# EAGLE design quickpi (EAGLE 7.7.0)
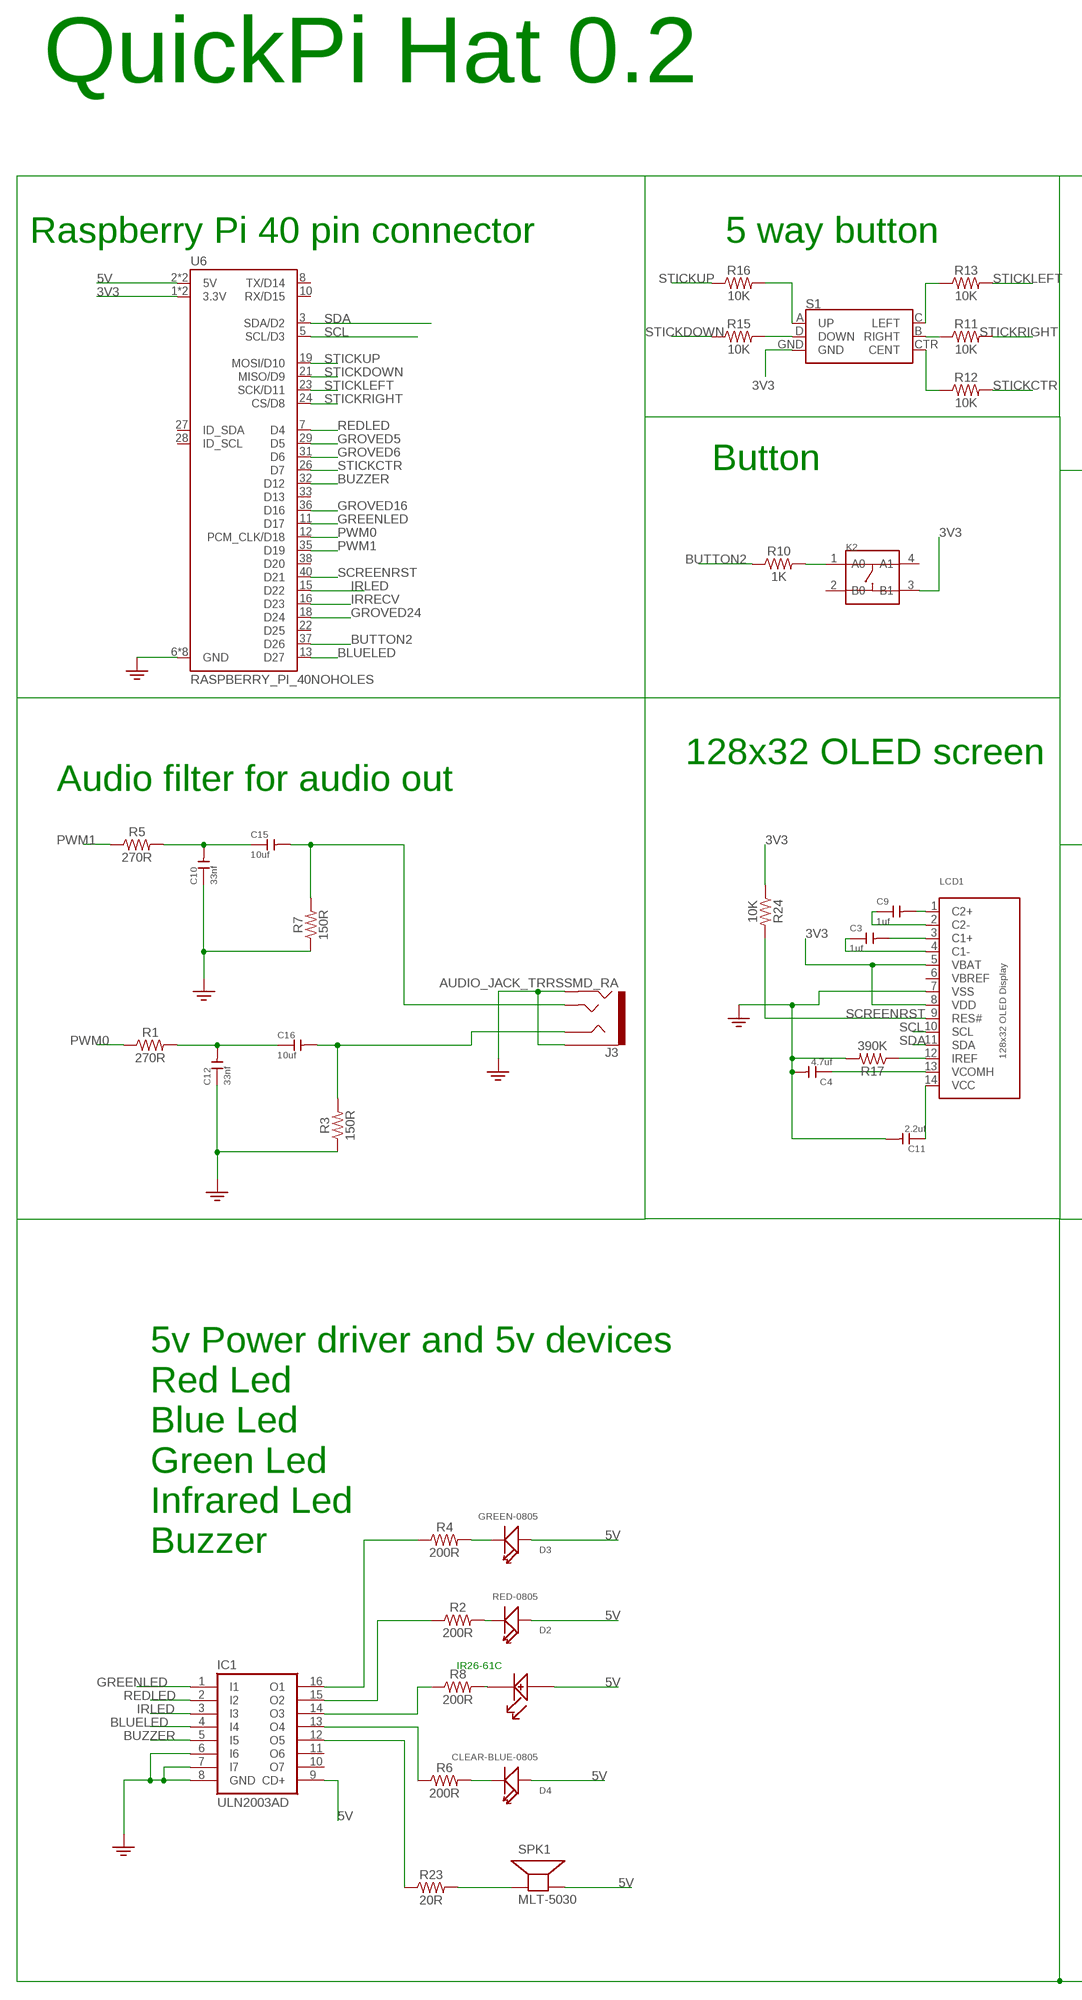
[diagram p0: schematic, sheet 1, part 1 of 2]
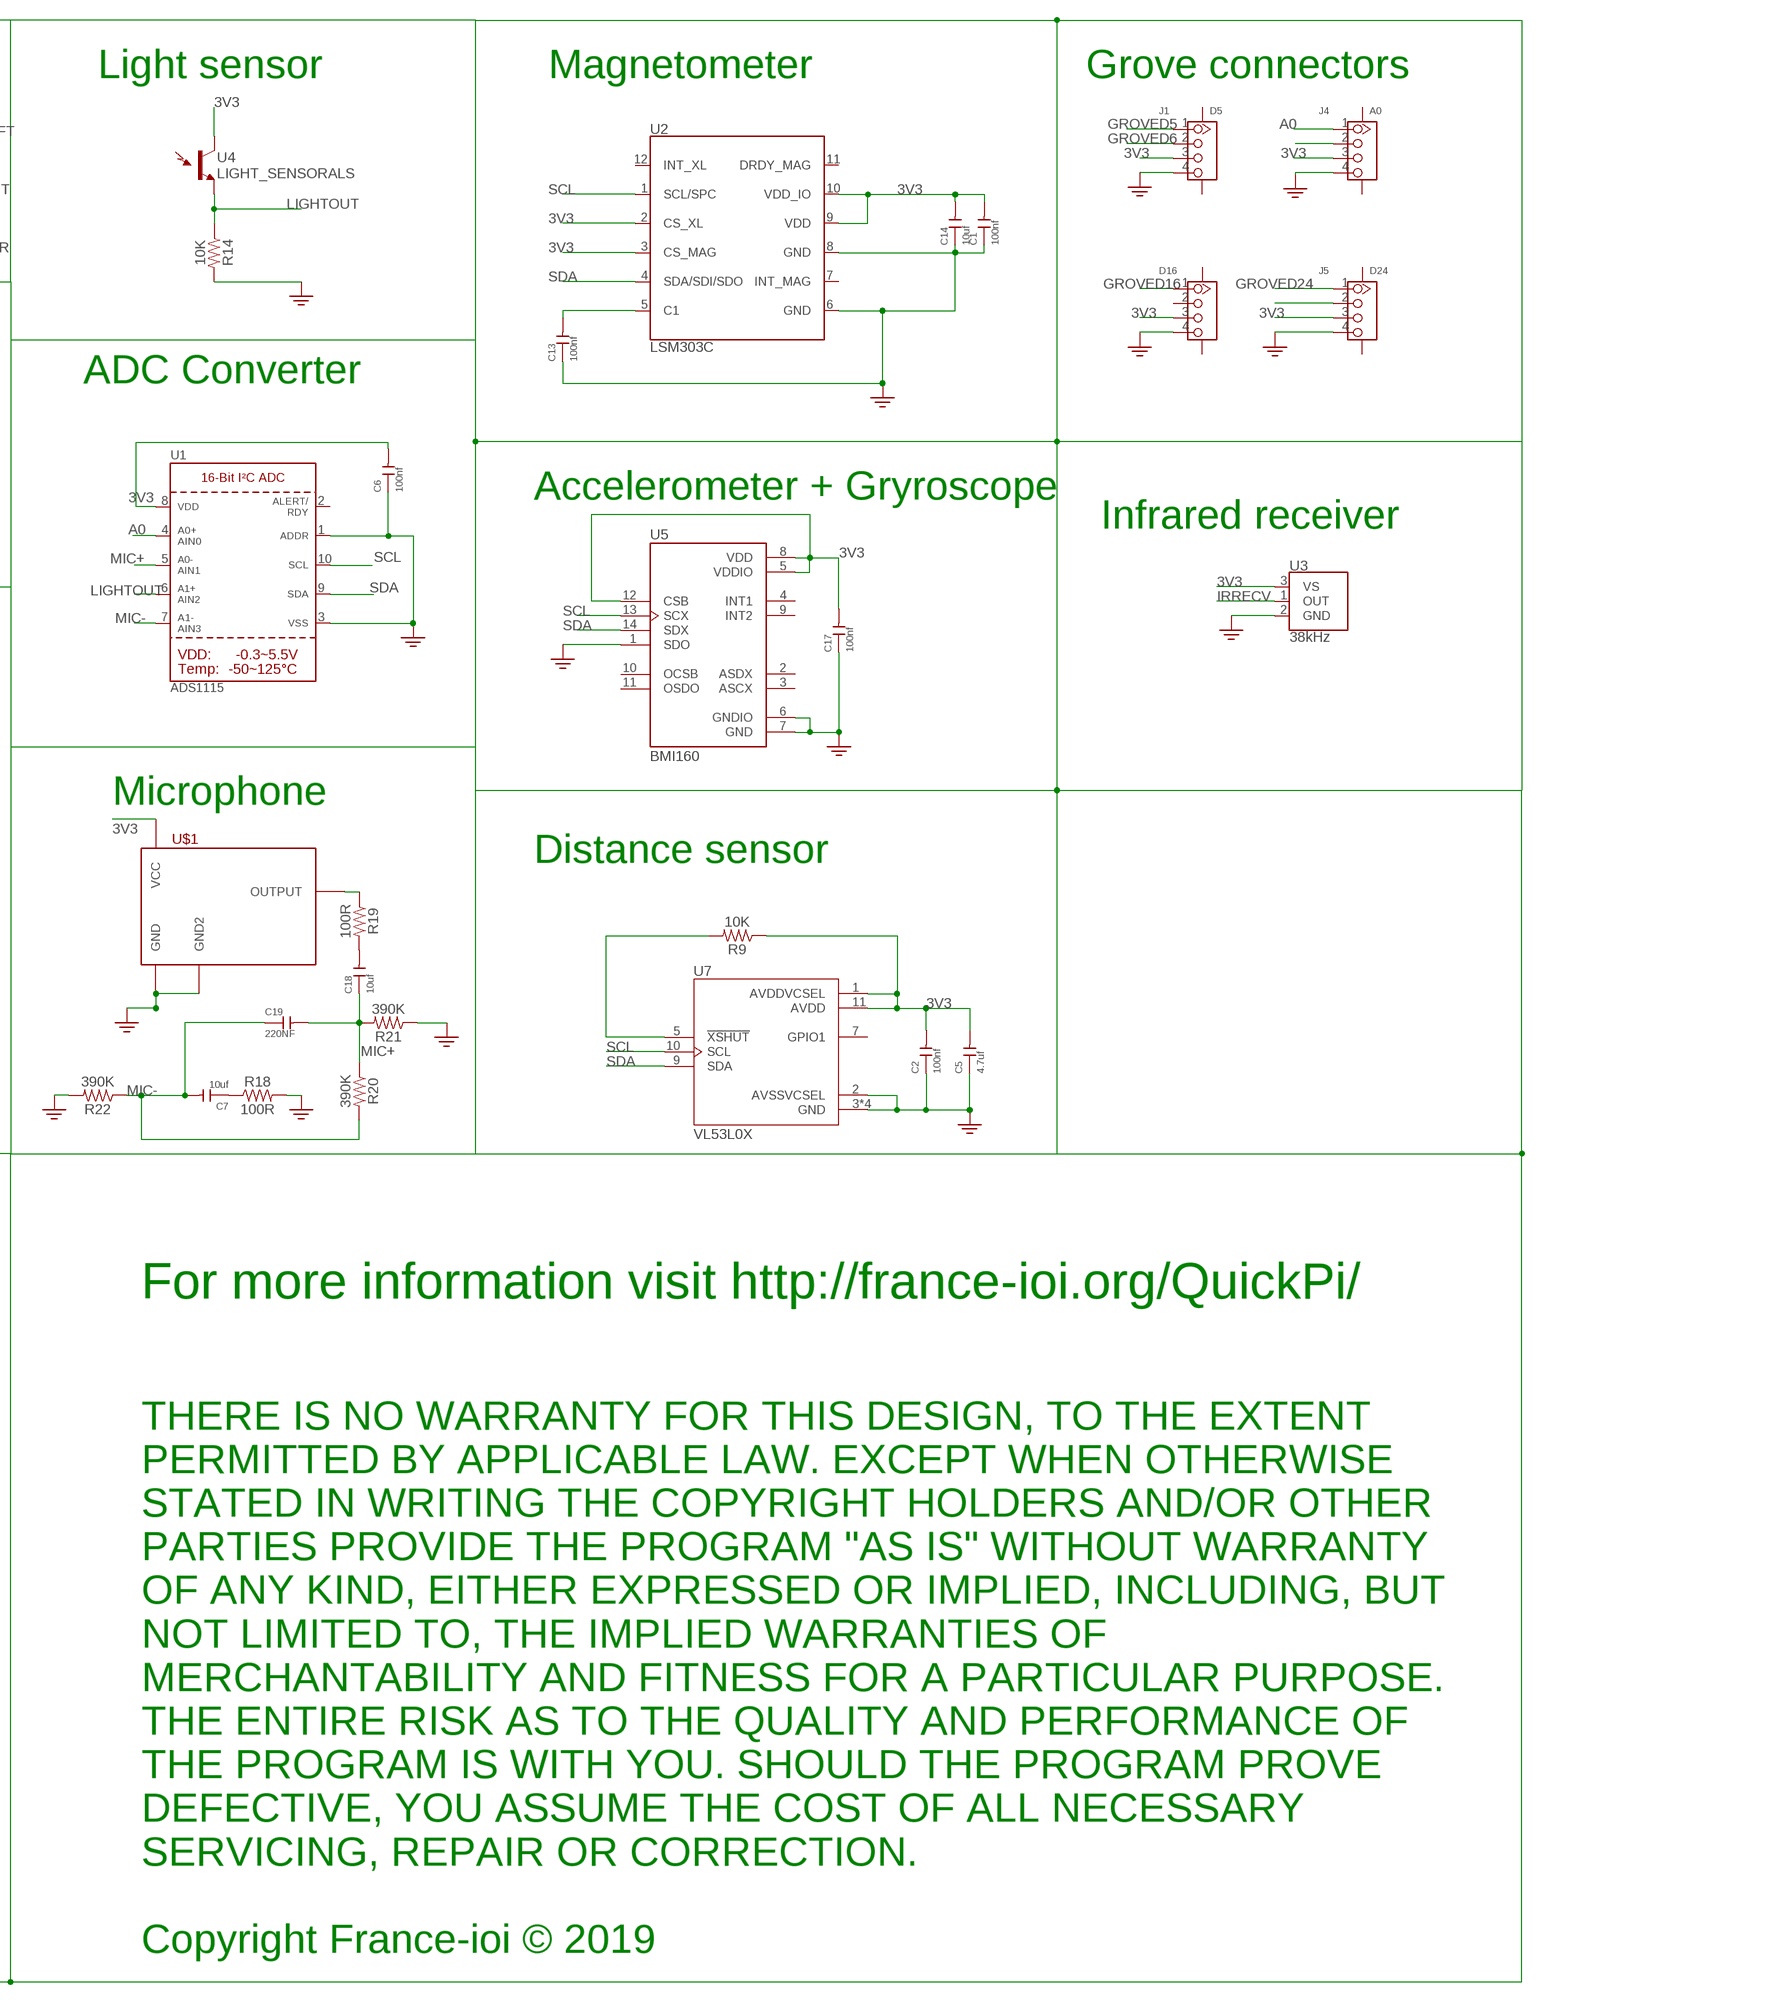
[diagram p1: schematic, sheet 1, part 2 of 2]

## Parts
C1  100nf  CERAMIC-100NF-25V-10%-X7R(0402)  [C0402]
C2  100nf  CERAMIC-100NF-25V-10%-X7R(0402)  [C0402]
C3  1uf  CERAMIC-1UF-10V-10%-X5R(0402)  [C0402]
C4  4.7uf  CERAMIC-4.7UF-6.3V-20%-X5R(0402)  [C0402]
C5  4.7uf  CERAMIC-4.7UF-6.3V-20%-X5R(0402)  [C0402]
C6  100nf  CERAMIC-100NF-25V-10%-X7R(0402)  [C0402]
C7  10uf  CERAMIC-1UF-10V-10%-X5R(0402)  [C0402]
C9  1uf  CERAMIC-1UF-10V-10%-X5R(0402)  [C0402]
C10  33nf  CERAMIC-10UF-6.3V-20%-X5R(0402)  [C0402]
C11  2.2uf  CERAMIC-4.7UF-6.3V-20%-X5R(0402)  [C0402]
C12  33nf  CERAMIC-10UF-6.3V-20%-X5R(0402)  [C0402]
C13  100nf  CERAMIC-100NF-25V-10%-X7R(0402)  [C0402]
C14  10uf  CERAMIC-10UF-6.3V-20%-X5R(0402)  [C0402]
C15  10uf  CERAMIC-10UF-6.3V-20%-X5R(0402)  [C0402]
C16  10uf  CERAMIC-10UF-6.3V-20%-X5R(0402)  [C0402]
C17  100nf  CERAMIC-100NF-25V-10%-X7R(0402)  [C0402]
C18  10uf  CERAMIC-1UF-10V-10%-X5R(0402)  [C0402]
C19  220NF  CERAMIC-220NF-16V-10%-X7R(0402)  [C0402]
D2  RED-0805  SMD-LED-CLEAR-RED(0805)  [LED-0805]
D3  GREEN-0805  SMD-LED-CLEAR-GREEN(0805)  [LED-0805]
D4  CLEAR-BLUE-0805  SMD-LED-CLEAR-BLUE(0805)  [LED-0805]
D16  GROVE-CONNECTOR-SMD-90D(4+2P-2.0)  [HW4-SMD-2.0-90D]
IC1  ULN2003AD  [SO16]
J1  D5  GROVE-CONNECTOR-SMD-90D(4+2P-2.0)  [HW4-SMD-2.0-90D]
J3  AUDIO_JACK_TRRSSMD_RA  [AUDIO_JACK_3.5MM_TRRS_SMD_RA]
J4  A0  GROVE-CONNECTOR-SMD-90D(4+2P-2.0)  [HW4-SMD-2.0-90D]
J5  D24  GROVE-CONNECTOR-SMD-90D(4+2P-2.0)  [HW4-SMD-2.0-90D]
K2  SMD-SWITCH-TACTILE-SPST-NO(4P-D6.0MM)  [SW4-SMD-6.0X6.0X5.0MM]
LCD1  DISP_OLED_UG-2832HSWEG02  [UG-2832HSWEG02_WRAPUNDER]
R1  270R  RESISTOR0402  [0402]
R2  200R  RESISTOR0402  [0402]
R3  150R  RESISTOR0402  [0402]
R4  200R  RESISTOR0402  [0402]
R5  270R  RESISTOR0402  [0402]
R6  200R  RESISTOR0402  [0402]
R7  150R  RESISTOR0402  [0402]
R8  200R  RESISTOR0402  [0402]
R9  10K  RESISTOR0402  [0402]
R10  1K  RESISTOR0402  [0402]
R11  10K  RESISTOR0402  [0402]
R12  10K  RESISTOR0402  [0402]
R13  10K  RESISTOR0402  [0402]
R14  10K  RESISTOR0402  [0402]
R15  10K  RESISTOR0402  [0402]
R16  10K  RESISTOR0402  [0402]
R17  390K  RESISTOR0402  [0402]
R18  100R  RESISTOR0402  [0402]
R19  100R  RESISTOR0402  [0402]
R20  390K  RESISTOR0402  [0402]
R21  390K  RESISTOR0402  [0402]
R22  390K  RESISTOR0402  [0402]
R23  20R  RESISTOR0402  [0402]
R24  10K  RESISTOR0402  [0402]
S1  JOYSTICK_MINI  [JOYSTICK_MINI]
SPK1  MLT-5030  SMT-0540-S-R  [SMT-0540-S-R]
U1  ADS1015  ADS1115  [MSOP10]
U2  LSM303C  [LGA-12]
U3  38kHz  TSOP38238  [TSOP382]
U4  LIGHT_SENSORALS  [ALS-PT19]
U5  BMI160  [PQFN50P300X250X88-14N]
U6  RASPBERRY_PI_40NOHOLES  [RASPBERRY_PI_SHIELD_NOHOLES]
U7  VL53L0X  [SENSOR_VL53L0X]
U$1  MEMS_MIC_SPU0414HR5H-SB  [CSP-4PIN]
U$2  IR26-61C/L302/TR8  [IR26-61C/L302/TR8]

## Nets
3V3: C1.2 C2.2 C5.2 C6.2 C14.2 C17.2 D16.3 J1.3 J4.3 J5.3 K2.3(B1) LCD1.5(VBAT) LCD1.8(VDD) R9.1 R24.1 S1.GND U1.8(VDD) U2.2(CS_XL) U2.3(CS_MAG) U2.9(VDD) U2.10(VDD_IO) U3.3(VS) U4.C(C1) U5.5(VDDIO) U5.8(VDD) U5.12(CSB) U6.1(3.3V) U6.17(3.3V) U7.1(AVDDVCSEL) U7.11(AVDD) U$1.VCC
5V: D2.+ D3.+ D4.+ IC1.9(CD+) SPK1.+(-) U6.2(5V) U6.4(5V) U$2.VCC(GND)
A0: J4.1 U1.4(AIN0)
BLUELED: IC1.4(I4) U6.13(D27)
BUTTON2: R10.1 U6.37(D26)
BUZZER: IC1.5(I5) U6.32(D12)
GND: C1.1 C2.1 C4.2 C5.1 C6.1 C10.1 C11.2 C12.1 C13.1 C14.1 C17.1 D16.4 IC1.6(I6) IC1.7(I7) IC1.8(GND) J1.4 J3.EARTH J3.RING2 J4.4 J5.4 LCD1.7(VSS) R3.1 R7.1 R14.2 R17.2 R18.2 R21.1 R22.2 U1.1(ADDR) U1.3(VSS) U2.6(GND) U2.8(GND) U3.2(GND) U5.1(SDO) U5.6(GNDIO) U5.7(GND) U6.6(GND) U6.9(GND) U6.14(GND) U6.20(GND) U6.25(GND) U6.30(GND) U6.34(GND) U6.39(GND) U7.2(AVSSVCSEL) U7.3(GND) U7.4(GND) U7.6(GND) U7.12(GND) U$1.GND U$1.GND2 ; supply symbol labelled GND2
GREENLED: IC1.1(I1) U6.11(D17)
GROVED5: J1.1 U6.29(D5)
GROVED6: J1.2 U6.31(D6)
GROVED16: D16.1 U6.36(D16)
GROVED24: J5.1 U6.18(D24)
IRLED: IC1.3(I3) U6.15(D22)
IRRECV: U3.1(OUT) U6.16(D23)
LIGHTOUT: R14.1 U1.6(AIN2) U4.E(E1)
MIC+: C18.1 C19.2 R20.1 R21.2 U1.5(AIN1)
MIC-: C7.2 C19.1 R20.2 R22.1 U1.7(AIN3)
N$1: C3.2 LCD1.3(C1+)
N$2: C16.2 J3.RING1 R3.2
N$3: D4.- R6.2
N$5: J4.2
N$6: J5.2
N$7: IC1.13(O4) R6.1
N$8: IC1.15(O2) R2.1
N$9: R8.2 U$2.GND(VCC)
N$10: C15.2 J3.TIP R7.2
N$11: IC1.16(O1) R4.1
N$12: D3.- R4.2
N$13: C10.2 C15.1 R5.2
N$14: C12.2 C16.1 R1.2
N$15: D2.- R2.2
N$16: R9.2 U7.5(!XSHUT)
N$17: C3.1 LCD1.4(C1-)
N$18: C13.2 U2.5(C1)
N$19: R19.1 U$1.OUTPUT
N$20: K2.1(A0) R10.2
N$21: IC1.14(O3) R8.1
N$22: R13.1 S1.C(LEFT)
N$23: R11.1 S1.B(RIGHT)
N$24: IC1.12(O5) R23.1
N$25: R23.2 SPK1.-(+)
N$26: C9.2 LCD1.1(C2+)
N$27: C9.1 LCD1.2(C2-)
N$28: LCD1.12(IREF) R17.1
N$29: R12.1 S1.CTR(CENT)
N$30: C11.1 LCD1.14(VCC)
N$31: R15.2 S1.D(DOWN)
N$32: R16.2 S1.A(UP)
N$33: C4.1 LCD1.13(VCOMH)
N$34: C18.2 R19.2
N$35: C7.1 R18.1
PWM0: R1.1 U6.12(PCM_CLK/D18)
PWM1: R5.1 U6.35(D19)
REDLED: IC1.2(I2) U6.7(D4)
SCL: LCD1.10(SCL) U1.10(SCL) U2.1(SCL/SPC) U5.13(SCX) U6.5(SCL/D3) U7.10(SCL)
SCREENRST: LCD1.9(RES#) R24.2 U6.40(D21)
SDA: LCD1.11(SDA) U1.9(SDA) U2.4(SDA/SDI/SDO) U5.14(SDX) U6.3(SDA/D2) U7.9(SDA)
STICKCTR: R12.2 U6.26(D7)
STICKDOWN: R15.1 U6.21(MISO/D9)
STICKLEFT: R13.2 U6.23(SCK/D11)
STICKRIGHT: R11.2 U6.24(CS/D8)
STICKUP: R16.1 U6.19(MOSI/D10)
Unconnected: D16.2 D16.SS1 D16.SS2 IC1.10(O7) IC1.11(O6) J1.SS1 J1.SS2 J4.SS1 J4.SS2 J5.SS1 J5.SS2 K2.2(B0) K2.4(A1) U1.2(ALERT/RDY) U2.7(INT_MAG) U2.11(DRDY_MAG) U2.12(INT_XL) U5.2(ASDX) U5.3(ASCX) U5.4(INT1) U5.9(INT2) U5.10(OCSB) U5.11(OSDO) U6.8(TX/D14) U6.10(RX/D15) U6.22(D25) U6.27(ID_SDA) U6.28(ID_SCL) U6.33(D13) U6.38(D20) U7.7(GPIO1)

## Notes on the sheet
- QuickPi Hat 0.2
- Light sensor | Magnetometer | Grove connectors
- Raspberry Pi 40 pin connector | 5 way button
- Button
- ADC Converter
- Accelerometer + Gryroscope
- Infrared receiver
- 128x32 OLED screen
- Audio filter for audio out
- Microphone
- Distance sensor
- For more information visit http://france-ioi.org/QuickPi/
- 5v Power driver and 5v devices
  Red Led
  Blue Led
  Green Led
  Infrared Led
  Buzzer
- IR26-61C
- THERE IS NO WARRANTY FOR THIS DESIGN, TO THE EXTENT
  PERMITTED BY APPLICABLE LAW. EXCEPT WHEN OTHERWISE 
  STATED IN WRITING THE COPYRIGHT HOLDERS AND/OR OTHER
  PARTIES PROVIDE THE PROGRAM "AS IS" WITHOUT WARRANTY 
  OF ANY KIND, EITHER EXPRESSED OR IMPLIED, INCLUDING, BUT 
  NOT LIMITED TO, THE IMPLIED WARRANTIES OF 
  MERCHANTABILITY AND FITNESS FOR A PARTICULAR PURPOSE. 
  THE ENTIRE RISK AS TO THE QUALITY AND PERFORMANCE OF 
  THE PROGRAM IS WITH YOU. SHOULD THE PROGRAM PROVE 
  DEFECTIVE, YOU ASSUME THE COST OF ALL NECESSARY
  SERVICING, REPAIR OR CORRECTION.
- Copyright France-ioi © 2019

## Power pins joined to a net without a drawn wire
VBREF: LCD1.6(VBREF)

## Library data of the parts
C1 C2 C6 C13 C17 = OPL_Capacitor:CERAMIC-100NF-25V-10%-X7R(0402): 302010024; MPN: CC0402KRX7R8BB104
C3 C9 = OPL_Capacitor:CERAMIC-1UF-10V-10%-X5R(0402): 302010040; MPN: CC0402KRX5R6BB105
C4 C5 = OPL_Capacitor:CERAMIC-4.7UF-6.3V-20%-X5R(0402): 302010019; MPN: CC0402MRX5R5BB475
C7 C18 = OPL_Capacitor:CERAMIC-1UF-10V-10%-X5R(0402): 302010040; MPN: CC0402KRX5R6BB105; VALUE: 1uf
C10 C12 = OPL_Capacitor:CERAMIC-10UF-6.3V-20%-X5R(0402): 302010053; MPN: CC0402MRX5R5BB106; VALUE: 10uf
C11 = OPL_Capacitor:CERAMIC-4.7UF-6.3V-20%-X5R(0402): 302010019; MPN: CC0402MRX5R5BB475; VALUE: 4.7uf
C14-C16 = OPL_Capacitor:CERAMIC-10UF-6.3V-20%-X5R(0402): 302010053; MPN: CC0402MRX5R5BB106
C19 = OPL_Capacitor:CERAMIC-220NF-16V-10%-X7R(0402): 302010051; MPN: CC0402KRX7R7BB224
D2 = OPL_Optoelectronics:SMD-LED-CLEAR-RED(0805): 304090046; MPN: 17-215SURC/S530-A2/TR8
D3 = OPL_Optoelectronics:SMD-LED-CLEAR-GREEN(0805): 304090057; MPN: 17-215SYGC/S530-E2/TR8
D4 = OPL_Optoelectronics:SMD-LED-CLEAR-BLUE(0805): 304090061; MPN: EL-17-215/BHC-AN1P2/3T
D16 J1 J4 J5 = OPL_Connector:GROVE-CONNECTOR-SMD-90D(4+2P-2.0): 320110032; VALUE: 4P-SMD-2.0-90D
IC1 = uln-udn:ULN2003A: DRIVER ARRAY
J3 = SparkFun-Connectors:AUDIO_JACK_TRRS: Audio Jack - 3.5mm TRRS (SMD) This is a 3.5mm TRRS SMD audio jack. TRRS connectors are the audio-style connectors that you see on some phones, MP3 players and development boards. TRRS stands for “tip, ring, ring, sleeve,” which reflects that this has three conductors and a ground. SparkFun Products: Audio Jack <https://www.sparkfun.com/products/12639> mbed Starter Kit <https://www.sparkfun.com/products/12968> SparkFun TRRS 3.5mm Jack Breakout <https://www.sparkfun.com/products/11570>; PROD_ID: CONN-10676; SF_ID: PRT-12639
K2 = OPL_Switch:SMD-SWITCH-TACTILE-SPST-NO(4P-D6.0MM): 311020004; MPN: DTSM-62K-S-V-T/R(SN431)
LCD1 = microbuilder-eited:DISP_OLED_UG-2832HSWEG02: 128x32 I2C 0.91" Monochrome OLED Display
R1-R24 = SparkFun-Resistors:RESISTOR: Generic Resistor Package
S1 = SparkFun-Switches:JOYSTICK_MINI: Small Tactile Joystick w/ Select Switch A 5-way tactile switch allows for a joystick-like interface in a very small package. Part #: 4UCON SF303GJ26 SparkFun Products 5-way Tactile Switch <https://www.sparkfun.com/products/10063> (COM-10063) Used on SparkFun Block for Intel® Edison - OLED <https://www.sparkfun.com/products/13035> (DEV-13035) Used on CAN-BUS Shield <https://www.sparkfun.com/products/13262> (DEV-13262); PROD_ID: SWCH-09905; SF_SKU: COM-10063
SPK1 = adafruit:SMT-0540-S-R: SMT-0549-S-R Small surface-mount magnetic buzzer
U1 = ADS1115:ADS1115: 16-Bit Del-Sig ADC Four single-ended inputs or two differential inputs Internal PGA I2C interface 2.0-5.5V; AVAILABILITY: Unavailable; DESCRIPTION: 16-Bit ADC with Integrated MUX PGA Comparator Oscillator and Reference; MF: Texas Instruments; MP: ADS1115; PACKAGE: XFQFN-10 Texas Instruments; PRICE: None
U2 = SparkFun-Sensors:LSM303C: Ultra-compact high-performance eCompass module 3D accelerometer and 3D magnetometer Datasheet <http://www.st.com/web/en/resource/technical/document/datasheet/DM00089896.pdf> SparkFun Products SparkFun 6 Degrees of Freedom Breakout - LSM303C <https://www.sparkfun.com/products/13303> (BOB-13303); PROD_ID: IC-12557
U3 = SparkFun-Sensors:TSOP382: Vishay Semiconductor TSOP32838 - 38kHz IR Receiver These products are miniaturized IR receiver modules for infrared remote control systems. A PIN diode and a preamplifier are assembled on a leadframe, the epoxy package contains an IR filter. The demodulated output signal can be directly connected to a microprocessor for decoding.; PROD_ID: SEN-10266
U4 = SparkFun-Sensors:LIGHT_SENSOR: Ambient Light Sensors - Phototransistors Low cost ambient light sensors, consisting of a phototransistor in miniature SMD packages. Output voltage varies with light intensity. SparkFun Products ALS-PT19 Light Sensor <https://www.sparkfun.com/products/12566> (SEN-12566) Ambient Light Sensor - TEMT6000 <https://www.sparkfun.com/products/8348> (SEN-08348) SparkFun Ambient Light Sensor Breakout - TEMT60000 <https://www.sparkfun.com/products/8688> (SEN-08688); PROD_ID: IC-11836; SF_ID: SEN-12566
U5 = BMI160:BMI160: BMI160 2.5 x 3 mm Tiaxial Accelerometer / Gyroscope Inertial Measurement Unit; AVAILABILITY: Unavailable; DESCRIPTION: BMI160 2.5 x 3 mm Tiaxial Accelerometer / Gyroscope Inertial Measurement Unit; MF: Bosch; MP: BMI160; PACKAGE: LGA-14 Bosch; PRICE: None
U6 = SparkFun-Connectors:RASPBERRY_PI_40
U7 = VL53L0X:VL53L0X: World smallest Time-of-Flight ranging and gesture detection sensor; AVAILABILITY: Unavailable; DESCRIPTION: World smallest Time-of-Flight _ToF_ ranging sensor; MF: STMicroelectronics; MP: VL53L0X; PACKAGE: None; PRICE: None
U$1 = fab:MEMS_MIC_SPU0414HR5H-SB
U$2 = pablo:IR26-61C/L302/TR8

## Board
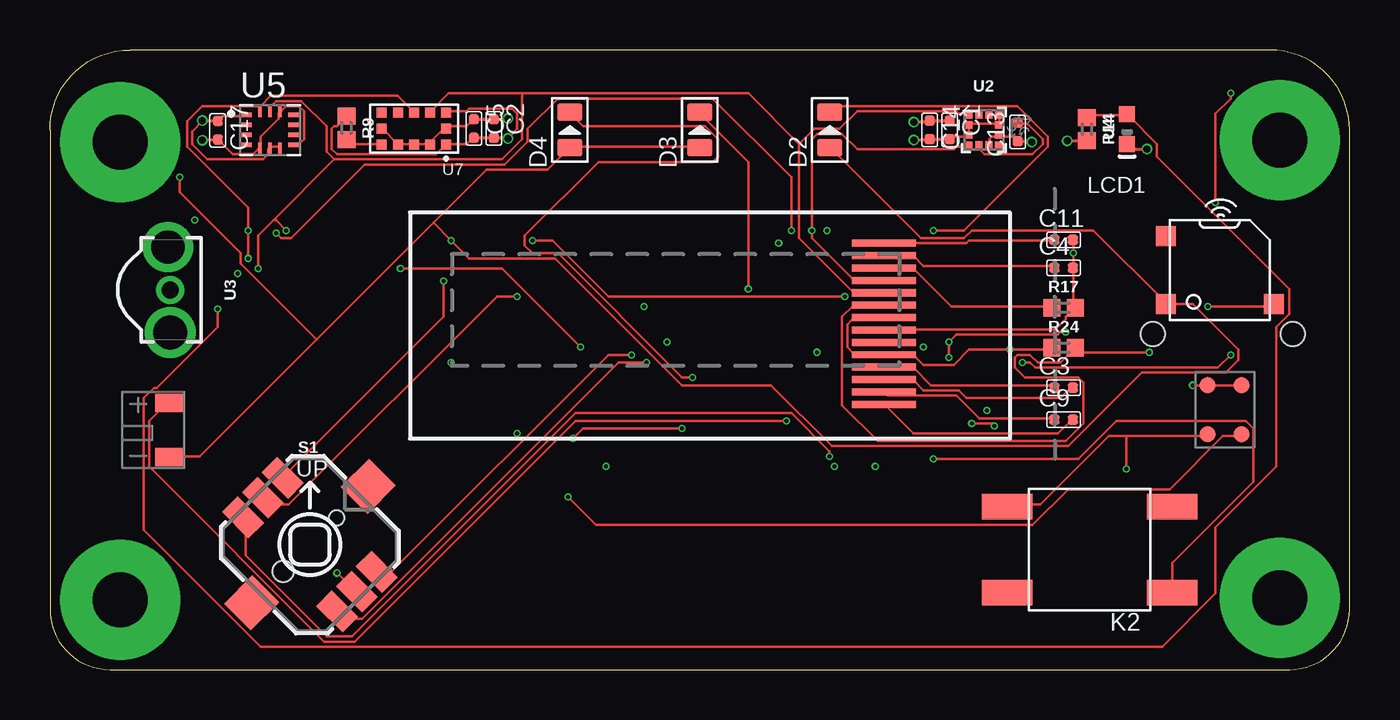
[diagram p2: board, top side]
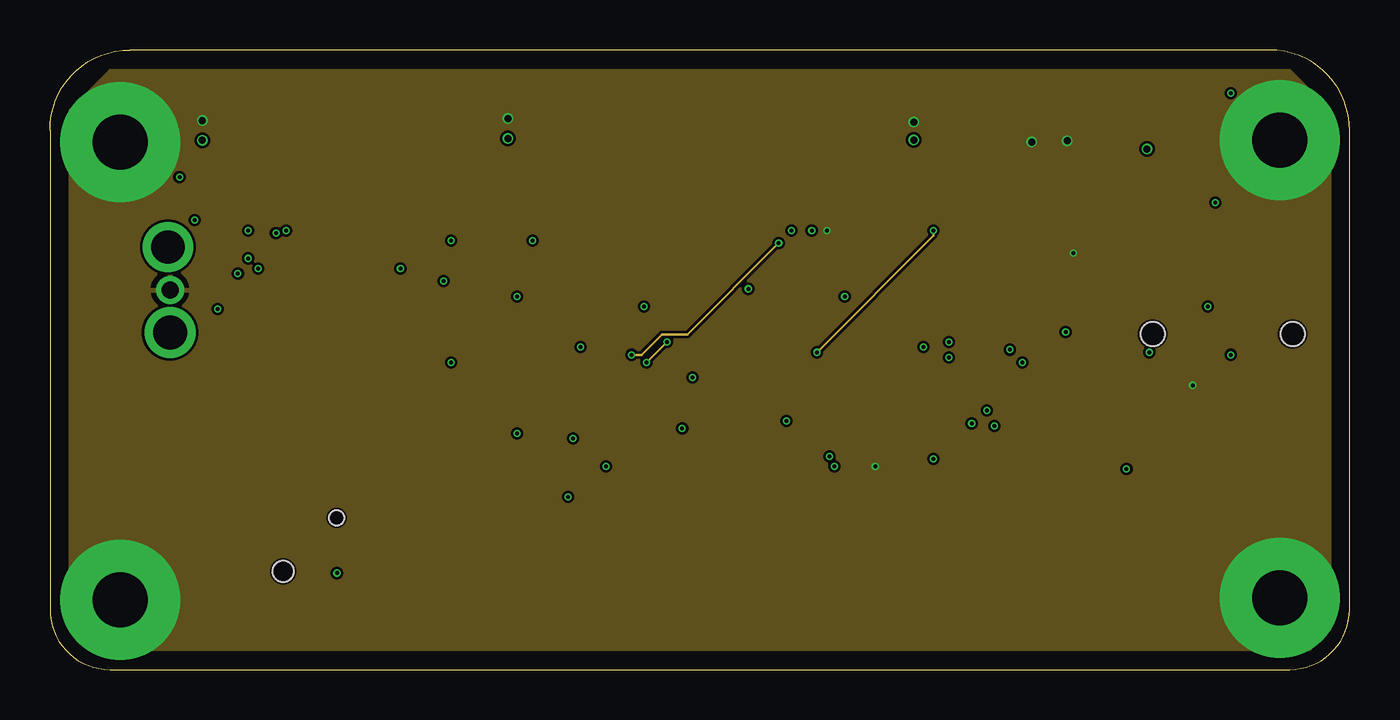
[diagram p3: board, inner layer Route2]
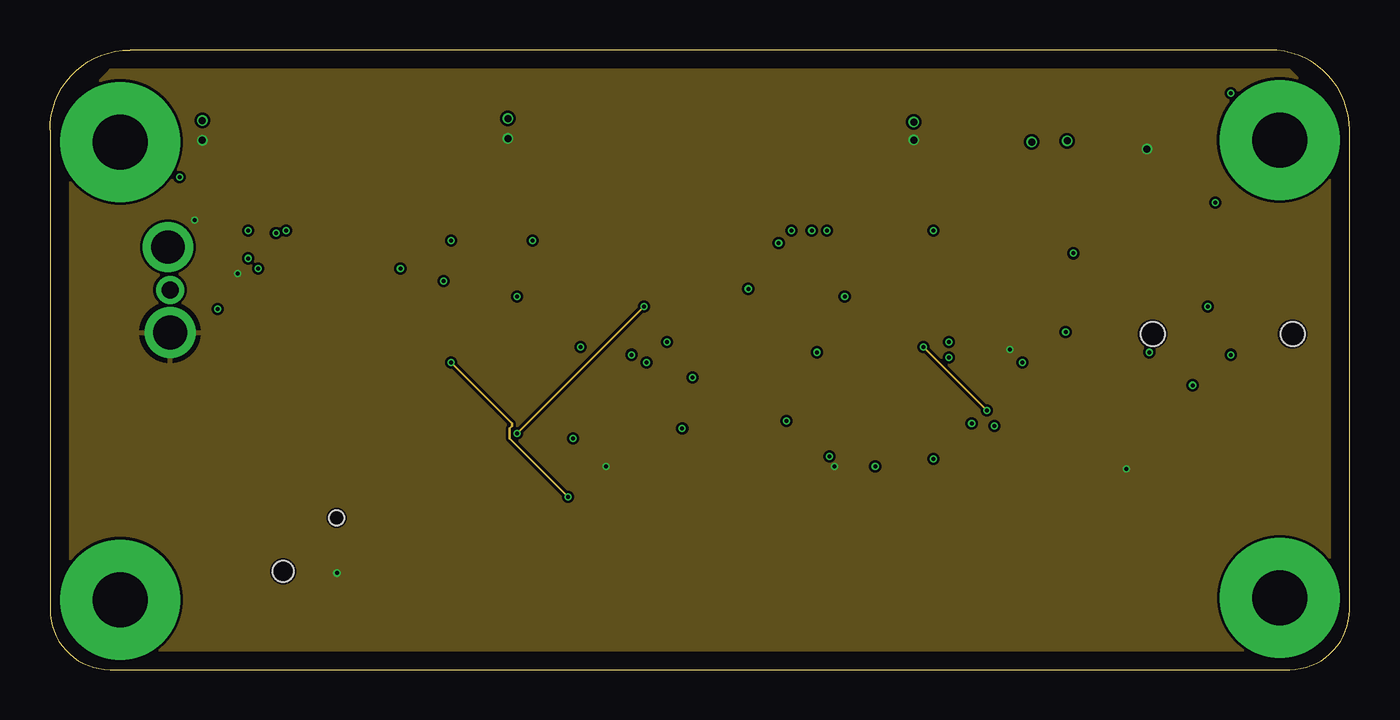
[diagram p4: board, inner layer Route15]
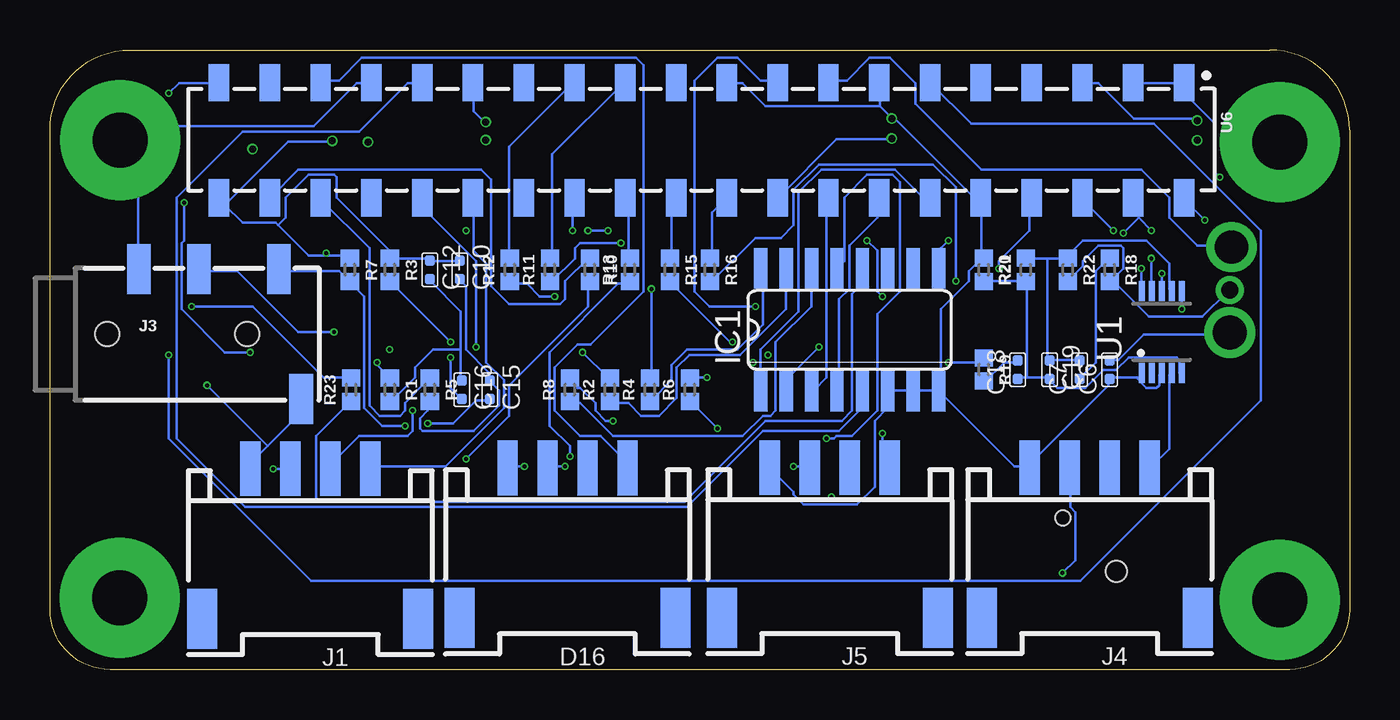
[diagram p5: board, bottom side, seen from below]

Size 65 x 31 mm. Coordinates in mm from the lower left corner, seen from the top.
Outline: 3,0 62,0 arc90 65,3 65,27 arc90 61,31 4,31 arc90 0,27 0,3 arc90 3,0
Copper layers (1*2+15*16): Top 0.035mm / dielectric 0.213359375mm / Route2 0.035mm / dielectric 1.0161mm / Route15 0.035mm / dielectric 0.213359375mm / Bottom 0.035mm
Design rules "SparkFun-4-layer-PCBWAY-LIMIT *": minimum track width 5mil, minimum drill 0.2mm, track to track 5mil, track to pad 5mil, pad to pad 5mil, via to via 5mil, smd to smd 0mil, copper to edge 5mil, drill to drill 5mil, minimum pad ring 3mil, minimum via ring 3mil, stop-mask expansion 4mil, vias tented up to drill 25mil, thermal gap 10mil
vRestrict: area 6.9,22.3 to 58.7,30.4

### Footprints (pad centres in the part's own frame; a part is rotated, then mirrored left to right if it is on the bottom)
C0402 = smd 0.5 x 0.5: 1 0,0.463; 2 0,-0.463
LED-0805 = smd 0.889 x 1.27: + -0.889,0; - 0.889,0
HW4-SMD-2.0-90D = smd 1.01 x 2.74: 1 -3,-0.1; 2 -1,-0.1; 3 1,-0.1; 4 3,-0.1 | smd 1.5 x 3: SS1 -5.4,7.4; SS2 5.4,7.4
SO16 = smd 0.66 x 2.032: 1 -4.445,-3.073; 2 -3.175,-3.073; 3 -1.905,-3.073; 4 -0.635,-3.073; 5 0.635,-3.073; 6 1.905,-3.073; 7 3.175,-3.073; 8 4.445,-3.073; 9 4.445,3.073; 10 3.175,3.073; 11 1.905,3.073; 12 0.635,3.073; 13 -0.635,3.073; 14 -1.905,3.073; 15 -3.175,3.073; 16 -4.445,3.073
AUDIO_JACK_3.5MM_TRRS_SMD_RA = smd 1.2 x 2.5: EARTH 11.3,-3.25; RING1 6.2,3.25; RING2 3.2,3.25; TIP 10.2,3.25 | hole 1.2: 1.6,0; 8.6,0
SW4-SMD-6.0X6.0X5.0MM = smd 2.54 x 1.27: 1 -4.129,2.159; 2 -4.129,-2.159; 3 4.129,-2.159; 4 4.129,2.159
UG-2832HSWEG02_WRAPUNDER = smd 3.2 x 0.35: 1 -6.28,-4.03; 2 -6.28,-3.41; 3 -6.28,-2.79; 4 -6.28,-2.17; 5 -6.28,-1.55; 6 -6.28,-0.93; 7 -6.28,-0.31; 8 -6.28,0.31; 9 -6.28,0.93; 10 -6.28,1.55; 11 -6.28,2.17; 12 -6.28,2.79; 13 -6.28,3.41; 14 -6.28,4.03
0402 = smd 0.85 x 0.9: 1 -0.58,0; 2 0.58,0
JOYSTICK_MINI = smd 1.85 x 1.1: A -3.325,1.4; B 3.325,1.4; C -3.325,-1.4; CTR -3.325,0; D 3.325,-1.4; GND 3.325,0 | smd 1.9 x 2: NC 0,4.13; NC@0 0,-4.13 | hole 0.75: 0,1.9 | hole 1.05: 0,-1.9
SMT-0540-S-R = smd 1 x 1: + 1.7,-2.7; - 1.7,2.7; M -1.7,-2.7
MSOP10 = smd 0.3 x 1: 1 -1,-2.05; 2 -0.5,-2.05; 3 0,-2.05; 4 0.5,-2.05; 5 1,-2.05; 6 1,2.05; 7 0.5,2.05; 8 0,2.05; 9 -0.5,2.05; 10 -1,2.05
LGA-12 = smd 0.375 x 0.35: 1 -0.75,0.75; 2 -0.75,0.25; 3 -0.75,-0.25; 4 -0.75,-0.75; 7 0.75,-0.75; 8 0.75,-0.25; 9 0.75,0.25; 10 0.75,0.75 | smd 0.35 x 0.375: 5 -0.25,-0.75; 6 0.25,-0.75; 11 0.25,0.75; 12 -0.25,0.75
TSOP382 = drill 1.67 pad 2.1: 1 -2.14,-0.1 | drill 0.85 pad 1.4: 2 0,0 | drill 1.7 pad 2.1: 3 2.14,0
ALS-PT19 = smd 0.8 x 0.8: C -0.75,0; E 0.75,0
PQFN50P300X250X88-14N = smd 0.59 x 0.25: 1 -1.165,0.75; 2 -1.165,0.25; 3 -1.165,-0.25; 4 -1.165,-0.75; 8 1.165,-0.75; 9 1.165,-0.25; 10 1.165,0.25; 11 1.165,0.75 | smd 0.25 x 0.59: 5 -0.5,-0.915; 6 0,-0.915; 7 0.5,-0.915; 12 0.5,0.915; 13 0,0.915; 14 -0.5,0.915
RASPBERRY_PI_SHIELD_NOHOLES = smd 1.02 x 1.87: 1 2.032,5.146; 2 2.032,-0.611; 3 4.572,5.146; 4 4.572,-0.611; 5 7.112,5.146; 6 7.112,-0.611; 7 9.652,5.146; 8 9.652,-0.611; 9 12.192,5.146; 10 12.192,-0.611; 11 14.732,5.146; 12 14.732,-0.611; 13 17.272,5.146; 14 17.272,-0.611; 15 19.812,5.146; 16 19.812,-0.611; 17 22.352,5.146; 18 22.352,-0.611; 19 24.892,5.146; 20 24.892,-0.611; 21 27.432,5.146; 22 27.432,-0.611; 23 29.972,5.146; 24 29.972,-0.611; 25 32.512,5.146; 26 32.512,-0.611; 27 35.052,5.146; 28 35.052,-0.611; 29 37.592,5.146; 30 37.592,-0.611; 31 40.132,5.146; 32 40.132,-0.611; 33 42.672,5.146; 34 42.672,-0.611; 35 45.212,5.146; 36 45.212,-0.611; 37 47.752,5.146; 38 47.752,-0.611; 39 50.292,5.146; 40 50.292,-0.611
SENSOR_VL53L0X = smd 0.5 x 0.5: 1 -1.6,0.8; 2 -0.8,0.8; 3 0,0.8; 4 0.8,0.8; 5 1.6,0.8; 6 1.6,0; 7 1.6,-0.8; 8 0.8,-0.8; 9 0,-0.8; 10 -0.8,-0.8; 11 -1.6,-0.8; 12 -1.6,0
CSP-4PIN = smd 0.8 x 0.8: GND 0.85,-1.23; GND2 -0.85,-1.23; OUTPUT -0.85,1.23; VCC 0.855,1.215
IR26-61C/L302/TR8 = smd 1.4 x 0.9: GND 0.05,-1.35; VCC 0.05,1.35

### Placement (x,y rotation side)
C1  45,27 0 top
C2  22.2,27.07 0 top
C3  50.7,14.1 90 top
C4  50.7,20.1 90 top
C5  21.2,27.07 0 top
C6  12,15 180 bottom
C7  13.5,15 180 bottom
C9  50.7,12.5 90 top
C10  44.5,20 0 bottom
C11  50.7,21.5 90 top
C12  46,20 0 bottom
C13  48.4,26.9 180 top
C14  44,27 0 top
C15  43,14 0 bottom
C16  44.4,14 0 bottom
C17  8.39,26.98 0 top
C18  16.6,15 180 bottom
C19  15,15 0 bottom
D2  39,27 90 top
D3  32.5,27 90 top
D4  26,27 90 top
D16  39.12,9.98 180 bottom
IC1  25,17 0 bottom
J1  51.98,9.95 180 bottom
J3  63.75,16.78 0 bottom
J4  13,10 180 bottom
J5  26,10 180 bottom
K2  52,6 180 top
LCD1  48,17.3 0 top
R1  48,14 270 bottom
R2  37,14 90 bottom
R3  48,20 270 bottom
R4  35,14 90 bottom
R5  46,14 270 bottom
R6  33,14 90 bottom
R7  50,20 270 bottom
R8  39,14 90 bottom
R9  14.83,27.1 270 top
R10  38,20 270 bottom
R11  40,20 90 bottom
R12  42,20 90 bottom
R13  36,20 90 bottom
R14  51.87,27.04 270 top
R15  34,20 270 bottom
R16  32,20 270 bottom
R17  50.7,18.1 0 top
R18  12,20 270 bottom
R19  18.3,15.01 270 bottom
R20  16.2,20 90 bottom
R21  18.3,20 270 bottom
R22  14.1,20 270 bottom
R23  49.94,14 90 bottom
R24  50.7,16.1 0 top
S1  13,6.25 315 top
SPK1  58.5,20 270 top
U1  9.4,16.9 0 bottom
U2  46.7,27 0 top
U3  6,19 270 top
U4  53.87,27.04 90 top
U5  11,27 0 top
U6  6.25,28.75 180 bottom
U7  18.2,27.07 180 top
U$1  58.75,13 180 top
U$2  6,12 180 top

### Tracks (layer width: path | path; a pad name or v marks a point on that pad's centre or on a via)
3V3  (via drill 0.2, 0.35)
  Top 0.127: 53.85,11.68 52.96,11.68 49.53,8.26 47.88,8.26 K2.3 | 53.85,11.68 57.78,11.68 U$1.VCC | R24.1 50.04,16 v48.01,16 45.97,16 45.21,15.24 43.69,15.24 43.18,15.75 41.78,15.75 LCD1.5 41.66,15.88 40.13,15.88 39.88,16.13 39.88,17.27 40.13,17.53 41.66,17.53 LCD1.8 | U5.8 12.19,26.29 12.45,26.29 12.7,26.54 12.7,27.94 12.45,28.19 11.81,28.19 11.56,27.94 U5.12 11.43,27.81 11.43,27.56 10.54,26.67 10.54,26.16 U5.5 10.41,26.04 10.16,25.78 9.14,25.78 8.51,26.42 C17.2 8.38,26.54 8.35,26.48 | U2.10 47.5,27.69 47.5,27.3 U2.9 47.37,27.3 45.97,27.3 U2.2 45.97,27.18 45.97,26.8 U2.3 45.85,26.67 45.21,26.67 45.09,26.54 C1.2 | C5.2 21.08,26.54 20.83,26.29 19.81,26.29 U7.1 19.68,26.16 19.3,25.78 14.35,25.78 14.1,26.04 14.1,27.05 14.22,27.18 14.35,27.18 14.73,27.56 R9.1 | U7.11 19.81,27.94 20.83,27.94 20.95,28.07 23.11,28.07 23.37,27.81 23.37,27.05 22.99,26.67 v22.9,26.57 | v14.35,4.83 15.24,3.94 S1.GND | v53.85,10.03 53.85,11.68
  Top 0.152: U4.C 54.12,26.04 v54.87,26.04 | v43.2,26.5 43.96,26.5 C14.2 C1.2 | C5.2 C2.2 22.86,26.61 v22.9,26.57 | 8.35,26.48 v7.62,26.48
  Bottom 0.127: C6.2 11.94,15.49 11.56,15.49 10.29,16.76 6.1,16.76 U3.3 | v9.4,19.81 9.4,19.05 U1.8 | v7.24,22.48 8.26,23.5 U6.1 | U6.17 28.57,23.62 25.65,26.54 22.99,26.54 v22.9,26.57 | v14.35,4.83 13.72,5.46 13.72,7.87 13.97,8.13 13.97,10.03 J4.3 | v27.81,10.16 27.05,10.16 J5.3 | v39.24,10.16 40.01,10.16 D16.3 | v53.85,10.03 53.09,10.03 J1.3
  pour Route15: 3,30 1,28 1,2 2,1 3,1 63,1 64,2 64,28 62,30
5V  (via drill 0.2)
  Top 0.127: D2.+ 39.12,26.04 43.56,21.59 45.72,21.59 46.1,21.97 52.2,21.97 55.75,18.41 SPK1.+ 55.88,18.29 57.15,18.29 59.44,16 59.44,15.49 58.8,14.86 54.61,14.86 50.93,11.18 39.12,11.18 36.07,14.22 31.62,14.22 25.27,20.57 20.95,20.57 v20.07,21.46 19.18,22.35 | D3.+ 32.38,26.16 26.04,26.16 D4.+ 25.91,26.04 24.89,25.02 21.84,25.02 19.18,22.35 | 19.18,22.35 13.34,16.51 | 13.34,16.51 7.49,10.67 5.97,10.67 U$2.VCC | v6.48,24.64 6.48,23.88 9.53,20.83 9.53,20.32 13.34,16.51
  Bottom 0.127: U6.4 10.79,29.34 8.38,29.34 U6.2 8.26,29.34 8.26,28.83 6.73,27.3 6.73,24.89 v6.48,24.64 | v20.07,21.46 20.45,21.08 20.45,20.19 IC1.9
A0
  Bottom 0.127: U1.4 9.02,14.73 9.02,11.05 9.91,10.16 J4.1
BLUELED
  Bottom 0.127: U6.13 23.62,23.5 23.62,22.61 25.02,21.21 25.02,19.05 25.53,18.54 25.53,13.97 IC1.4
BUTTON2
  Bottom 0.127: R10.1 38.1,20.57 39.24,19.43 39.24,18.54 39.5,18.29 42.04,18.29 42.93,19.18 42.93,24.51 43.43,25.02 52.58,25.02 53.98,23.62 U6.37
BUZZER
  Bottom 0.127: U6.32 46.48,29.34 47.12,29.34 49.53,26.92 55.37,26.92 58.67,23.62 58.67,11.56 55.24,8.13 33.15,8.13 29.34,11.94 25.53,11.94 24.38,13.08 24.38,13.84 IC1.5
GND  (via drill 0.2, 0.35, 2.75 pad 6)
  Top 0.127: C11.2 51.18,21.46 v51.18,20.83 51.18,20.19 C4.2 51.18,20.07 51.18,18.16 R17.2 51.18,18.03 50.8,17.65 50.8,17.53 50.29,17.02 41.78,17.02 LCD1.7 | 18.92,26.29 18.29,26.29 U7.3 18.16,26.29 17.53,26.29 U7.4 17.4,26.29 16.64,27.05 U7.6 | 18.92,26.29 19.68,27.05 U7.12 19.81,27.18 20.83,27.18 21.08,27.43 C5.1 | 18.92,26.29 U7.2 | U$1.GND2 59.56,14.22 57.91,14.22 U$1.GND 57.78,14.22 v57.15,14.22 | U2.6 46.99,26.29 46.99,26.54 47.12,26.67 47.37,26.67 U2.8 47.5,26.67 48.26,26.67 48.39,26.54 C13.1 | U5.7 11.43,26.16 11.05,26.16 U5.6 10.92,26.04 10.92,25.78 10.67,25.53 7.87,25.53 7.11,26.29 7.11,26.92 7.62,27.43 v7.62,27.47 | U5.1 9.78,27.69 8.64,27.69 8.51,27.56 C17.1 | 49.02,26.44 49.02,26.42 v49.1,26.4
  Top 0.152: v43.2,27.4 43.94,27.4 C14.1 C1.1 | C13.1 49.02,26.44 49.06,26.44 | C5.1 C2.1 22.86,27.53 v22.9,27.57 | C17.1 7.65,27.44 v7.62,27.47 | v50.88,26.46 R14.2
  Bottom 0.127: 10.67,14.61 10.54,14.61 10.41,14.73 U1.1 | 10.67,14.61 11.94,14.61 C6.1 12.06,14.48 12.06,14.22 15.88,10.41 15.88,10.16 J4.4 16,10.16 16.76,10.16 20.45,13.84 IC1.8 | 10.67,14.61 10.16,14.1 9.65,14.1 9.53,14.22 9.53,14.73 U1.3 | IC1.8 20.57,13.97 21.72,13.97 IC1.7 21.84,13.97 22.99,13.97 IC1.6 23.11,13.84 23.11,13.08 23.75,12.45 23.75,9.14 24.64,8.26 27.3,8.26 27.81,8.76 27.81,8.89 28.96,10.03 J5.4 | C10.1 44.58,20.45 45.97,20.45 C12.1 46.1,20.57 47.88,20.57 R3.1 48.01,20.7 48.01,20.95 50.67,23.62 50.67,24.64 50.8,24.77 52.07,24.77 53.21,23.62 53.21,22.61 53.59,22.23 | 53.59,22.23 53.72,22.35 55.37,22.35 56.26,23.24 | 53.59,22.23 52.07,20.7 50.04,20.7 R7.1 | 56.26,23.24 56.52,23.5 U6.39 56.26,23.24 | 54.1,11.18 54.86,10.41 54.86,10.16 J1.4 | 54.1,11.18 52.45,12.83 52.45,13.46 J3.EARTH | R22.2 14.1,19.43 13.34,20.19 13.34,20.45 12.57,21.21 11.43,21.21 11.3,21.08 11.3,20.07 11.94,19.43 R18.2 11.94,19.3 11.68,19.3 10.03,17.65 7.37,17.65 6.1,18.92 U3.2 | U6.6 13.34,29.34 12.57,29.34 10.79,27.56 7.62,27.56 v7.62,27.47 | 23.5,28.19 23.5,29.34 U6.14 | 23.5,28.19 22.99,27.69 v22.9,27.57 22.86,27.69 18.8,23.62 18.54,23.62 U6.9 18.41,23.5 18.41,20.7 R21.1 18.41,20.57 19.05,19.94 19.05,19.43 20.45,18.03 20.45,13.97 IC1.8 | 23.5,28.19 29.21,28.19 30.35,29.34 31.11,29.34 U6.20 | v38.86,21.97 38.86,23.5 U6.25 | U6.30 43.81,29.34 43.81,27.94 43.31,27.43 v43.2,27.4 | U6.34 49.02,29.34 49.66,29.34 51.82,27.18 60.83,27.18 61.47,26.54 v61.5,26.5 61.47,26.42 60.58,25.53 60.58,20.07 J3.RING2 | v41.27,10.16 42.04,10.16 D16.4 | v57.15,14.22 54.1,11.18 | 56.26,23.24 53.09,26.42 50.93,26.42 v50.88,26.46
  other vias: 3.5,26.4 3.5,3.5 61.51,3.58
  pour Route2: 1,28 3,30 62,30 64,28 64,2 63,1 2,1 1,2
GREENLED
  Bottom 0.127: U6.11 21.08,23.62 21.34,23.62 22.73,25.02 26.42,25.02 27.56,23.88 27.56,17.91 29.46,16 29.46,13.97 IC1.1
GROVED5
  Bottom 0.127: U6.29 43.81,23.5 43.81,20.95 43.18,20.32 43.18,15.37 42.29,14.48 42.29,13.08 45.21,10.16 48.9,10.16 J1.1
GROVED6  (via drill 0.2)
  Route15 0.127: v46.86,12.95 v43.69,16.13
  Bottom 0.127: v43.69,16.13 43.69,20.45 46.35,23.11 46.35,23.5 U6.31 | v46.86,12.95 46.86,11.94 47.12,11.68 49.53,11.68 51.05,10.16 J1.2
GROVED16
  Bottom 0.127: U6.36 51.44,29.46 50.55,29.46 49.4,30.61 35.69,30.61 35.31,30.23 35.31,18.92 37.97,16.26 38.61,16.26 39.75,15.11 39.75,12.95 38.48,11.68 37.47,11.68 36.2,10.41 36.2,10.16 D16.1
GROVED24  (via drill 0.2)
  Route15 0.127: v23.37,11.81 v29.72,18.16
  Bottom 0.127: v29.72,18.16 32,18.16 32.77,18.92 32.77,29.46 31.62,30.61 30.61,30.61 29.46,29.46 28.7,29.46 U6.18 | v23.37,11.81 23.37,10.41 23.11,10.16 J5.1
IRLED
  Bottom 0.127: U6.15 26.16,23.5 26.16,14.61 26.8,13.97 IC1.3
IRRECV
  Bottom 0.127: U6.16 26.04,29.46 25.15,29.46 24,30.61 22.99,30.61 21.72,29.34 21.72,28.32 18.41,25.02 10.41,25.02 9.02,23.62 9.02,22.61 7.62,21.21 5.97,21.21 U3.1
LIGHTOUT  (via drill 0.2)
  Top 0.127: 51.9,27.73 51.94,27.73 | 51.94,27.73 53.81,27.73 53.85,27.69 U4.E 53.98,27.69 55.37,26.29 55.37,25.65 61.98,19.05 61.98,17.78 61.34,17.14 61.34,10.16 58.29,7.11 58.29,3.81 55.63,1.14 10.54,1.14 4.7,6.99 4.7,13.59 5.21,14.1 5.33,14.1 8.38,17.14 v8.38,18.03 | 51.94,27.73 51.94,27.69 R14.1
  Bottom 0.127: v8.38,18.03 8.38,18.92 U1.6
MIC+
  Bottom 0.127: R21.2 18.29,19.43 16.26,19.43 R20.1 16.13,19.3 16.13,14.61 | 16.13,14.61 16.51,14.61 C18.1 | 16.13,14.61 15.11,14.61 C19.2 14.99,14.48 14.61,14.1 13.21,14.1 12.32,14.99 11.68,14.99 11.05,15.62 8.64,15.62 8.51,15.49 8.51,14.86 U1.5
MIC-
  Bottom 0.127: C7.2 13.59,15.49 14.99,15.49 C19.1 15.11,15.49 15.11,20.57 | 15.11,20.57 16.13,20.57 R20.2 | 15.11,20.57 14.22,20.57 R22.1 14.1,20.7 13.34,21.46 10.16,21.46 9.02,20.32 9.02,19.05 U1.7
N$1
  Top 0.127: C3.2 51.05,14.1 50.55,13.59 45.85,13.59 45.47,13.97 43.69,13.97 43.18,14.48 41.78,14.48 LCD1.3
N$2  (via drill 0.2)
  Top 0.127: v44.96,15.62 v44.96,16.38 45.34,16.76 50.42,16.76 50.55,16.89 v50.8,16.89
  Bottom 0.127: v44.96,15.62 44.96,14.1 44.45,13.59 C16.2 | v44.96,16.38 47.88,19.3 R3.2 | v50.8,16.89 52.58,16.89 55.63,19.94 57.53,19.94 J3.RING1
N$3  (via drill 0.2)
  Top 0.127: v32.13,14.61 31.62,14.61 25.4,20.83 24.13,20.83 23.75,21.21 23.75,21.72 27.43,25.4 33.15,25.4 33.4,25.65 33.4,26.54 32.77,27.18 26.67,27.18 26.04,27.81 D4.-
  Bottom 0.127: v32.13,14.61 32.89,14.61 R6.2
N$7  (via drill 0.2)
  Top 0.127: v31.62,12.06 26.67,12.06 v26.16,11.56
  Bottom 0.127: v31.62,12.06 32.89,13.34 R6.1 | v26.16,11.56 25.78,11.56 25.65,11.68 24.89,11.68 23.62,12.95 23.62,17.78 22.48,18.92 22.48,24.38 22.86,24.77 24.13,24.77 25.27,23.62 25.27,20.45 25.53,20.19 IC1.13
N$8
  Bottom 0.127: R2.1 36.96,13.34 36.07,13.34 35.43,12.7 34.54,12.7 33.66,13.59 33.66,15.11 33.02,15.75 30.48,15.75 28.19,18.03 28.19,20.07 IC1.15
N$9  (via drill 0.2)
  Top 0.127: v36.83,12.45 26.29,12.45 15.24,1.4 13.72,1.4 4.95,10.16 4.95,12.45 5.84,13.34 U$2.GND
  Bottom 0.127: v36.83,12.45 37.21,12.45 37.72,12.95 37.72,13.34 38.48,14.1 38.61,14.1 38.99,14.48 R8.2
N$10  (via drill 0.2)
  Top 0.127: v46.1,12.32 47.12,12.32 v47.24,12.19
  Bottom 0.127: v46.1,12.32 44.83,12.32 43.69,13.46 43.05,13.46 C15.2 | v47.24,12.19 48.39,12.19 49.28,13.08 49.28,18.67 49.91,19.3 R7.2 50.04,19.43 50.55,19.94 53.47,19.94 J3.TIP
N$11
  Bottom 0.127: R4.1 34.92,13.46 33.91,14.48 33.91,15.24 33.15,16 30.61,16 29.34,17.27 29.34,20.07 IC1.16
N$12  (via drill 0.2)
  Top 0.127: v34.92,19.05 34.92,25.4 32.51,27.81 D3.-
  Bottom 0.127: v34.92,19.05 34.92,14.61 R4.2
N$13
  Bottom 0.127: C10.2 44.45,19.43 44.2,19.18 44.2,16 43.05,14.86 43.05,14.48 C15.1 42.93,14.35 42.55,13.97 42.55,13.21 43.81,11.94 46.35,11.94 46.48,12.06 46.48,12.57 46.1,12.95 46.1,13.34 R5.2
N$14
  Bottom 0.127: 44.45,16 44.45,17.91 45.97,19.43 C12.2 | 44.45,16 44.45,14.48 C16.1 | 44.45,16 45.85,16 46.74,15.11 46.74,14.61 47.88,13.46 R1.2
N$15  (via drill 0.2)
  Top 0.127: v44.2,21.97 45.72,21.97 49.91,26.16 49.91,26.67 48.39,28.19 39.37,28.19 39.12,27.94 D2.-
  Route2 0.127: v38.35,15.88 44.2,21.72 v44.2,21.97
  Bottom 0.127: v38.35,15.88 37.08,14.61 R2.2
N$16
  Top 0.127: U7.5 16.51,26.29 14.99,26.29 14.86,26.42 R9.2
N$17
  Top 0.127: C3.1 50.16,14.22 44.07,14.22 43.18,15.11 41.78,15.11 LCD1.4
N$18
  Top 0.127: U2.5 46.48,26.16 46.48,26.04 46.74,25.78 49.15,25.78 49.66,26.29 49.66,26.54 48.9,27.3 48.51,27.3 C13.2
N$19  (via drill 0.2)
  Top 0.127: v25.91,8.64 27.3,7.24 49.15,7.24 50.93,9.02 56.01,9.02 58.67,11.68 59.56,11.68 U$1.OUTPUT
  Route15 0.127: v25.91,8.64 22.99,11.56 22.99,12.06 23.11,12.19 23.11,12.32 v20.07,15.37
  Bottom 0.127: v20.07,15.37 18.54,15.37 18.41,15.49 R19.1
N$20  (via drill 0.2)
  Top 0.127: v44.2,10.54 51.44,10.54 53.34,12.45 59.82,12.45 60.2,12.06 60.2,9.4 56.13,5.33 56.13,3.94 K2.1
  Bottom 0.127: v44.2,10.54 42.04,12.7 42.04,14.22 38.1,18.16 38.1,19.3 R10.2
N$21
  Bottom 0.127: R8.1 38.99,13.34 38.48,13.34 36.83,11.68 30.35,11.68 29.34,12.7 28.96,12.7 28.7,12.95 28.7,16.38 26.92,18.16 26.92,20.07 IC1.14
N$22  (via drill 0.2)
  Top 0.127: v38.99,10.67 38.99,10.92 37.08,12.83 26.29,12.83 15.11,1.65 13.84,1.65 9.78,5.71 9.78,7.49 S1.C
  Bottom 0.127: v38.99,10.67 38.99,11.18 40.01,12.19 40.01,15.88 36.58,19.3 36.07,19.3 R13.1
N$23  (via drill 0.2)
  Top 0.127: v29.08,15.75 27.94,15.75 17.14,4.95 16.38,4.95 S1.B
  Route2 0.127: v36.45,21.34 31.88,16.76 30.61,16.76 29.59,15.75 v29.08,15.75
  Bottom 0.127: v36.45,21.34 38.48,21.34 38.73,21.08 38.73,20.57 39.88,19.43 R11.1
N$24
  Bottom 0.127: R23.1 50.04,13.34 51.69,11.68 51.69,8.51 51.56,8.38 33.27,8.38 29.21,12.45 25.4,12.45 24.89,12.95 24.89,18.8 24.38,19.3 24.38,20.07 IC1.12
N$25  (via drill 0.2)
  Top 0.127: v57.91,18.16 60.96,18.16 61.09,18.29 SPK1.-
  Bottom 0.127: v57.91,18.16 54.86,18.16 51.31,14.61 50.04,14.61 R23.2
N$26
  Top 0.127: C9.2 51.05,12.45 50.42,11.81 43.18,11.81 41.78,13.21 LCD1.1
N$27
  Top 0.127: C9.1 50.16,12.57 46.48,12.57 45.34,13.72 41.91,13.72 41.78,13.84 LCD1.2
N$28
  Top 0.127: R17.1 50.04,18.16 45.09,18.16 43.18,20.07 41.78,20.07 LCD1.12
N$29  (via drill 0.2)
  Top 0.127: v39.75,18.67 27.94,18.67 25.15,21.46 v24.13,21.46 | v23.37,18.67 22.35,18.67 11.94,8.26 10.92,8.26 10.67,8.51 S1.CTR
  Bottom 0.127: v39.75,18.67 40.51,18.67 41.15,19.3 41.91,19.3 R12.1 | v24.13,21.46 23.62,20.95 23.62,18.92 v23.37,18.67
N$30
  Top 0.127: C11.1 50.16,21.46 45.97,21.46 45.85,21.34 41.78,21.34 LCD1.14
N$31  (via drill 0.2)
  Top 0.127: v29.84,15.37 28.45,15.37 15.62,2.54 14.73,2.54 14.48,2.79 S1.D
  Route2 0.127: v29.84,15.37 v30.86,16.38
  Bottom 0.127: v30.86,16.38 30.99,16.38 33.91,19.3 R15.2
N$32  (via drill 0.2)
  Top 0.127: v19.68,19.43 19.68,17.65 11.68,9.65 S1.A
  Bottom 0.127: v19.68,19.43 19.68,24.13 20.83,25.27 26.54,25.27 27.81,24 27.81,22.23 28.45,21.59 29.72,21.59 31.88,19.43 R16.2
N$33
  Top 0.127: C4.1 50.16,20.19 43.69,20.19 43.18,20.7 41.78,20.7 LCD1.13
N$34
  Bottom 0.127: C18.2 16.64,15.37 17.27,15.37 18.29,14.35 R19.2
N$35
  Bottom 0.127: C7.1 13.46,14.61 12.7,15.37 12.7,19.94 12.06,20.57 R18.1
PWM0  (via drill 0.2)
  Top 0.127: v48.64,15.37 49.02,15.37 49.28,15.11 58.42,15.11 v59.05,15.75
  Bottom 0.127: v48.64,15.37 48.64,15.24 48.01,14.61 R1.1 | v59.05,15.75 59.05,11.56 51.94,4.45 13.46,4.45 4.45,13.46 4.45,21.97 9.78,27.3 18.92,27.3 20.95,29.34 U6.12
PWM1
  Bottom 0.127: R5.1 46.1,14.48 47.24,13.34 47.24,12.95 47.5,12.7 48.51,12.7 49.02,13.21 49.02,21.08 51.44,23.5 U6.35
REDLED  (via drill 0.2)
  Top 0.127: v17.53,20.07 22.61,20.07 v26.54,16.13
  Bottom 0.127: v17.53,20.07 17.53,20.45 16,21.97 16,23.5 U6.7 | v26.54,16.13 28.07,14.61 28.07,13.97 IC1.2
SCL  (via drill 0.2)
  Top 0.127: 37.47,26.29 38.23,27.05 39.5,27.05 40.39,27.94 45.34,27.94 45.47,27.81 45.85,27.81 U2.1 | 37.47,26.29 37.47,21.59 40.13,18.92 41.66,18.92 LCD1.10 | 23.62,28.83 34.92,28.83 37.47,26.29 | 23.62,28.83 19.94,28.83 19.05,27.94 U7.10 | 14.22,25.53 13.84,25.91 13.84,27.18 12.57,28.45 11.3,28.45 11.05,28.19 11.05,27.94 U5.13 | 14.22,25.53 22.61,25.53 23.62,26.54 23.62,28.83 | v10.41,20.07 10.41,21.72 11.18,22.48 | 14.22,25.53 11.18,22.48 | v11.81,21.97 11.3,22.48 11.18,22.48
  Bottom 0.127: v10.41,20.07 10.41,19.05 U1.10 | v11.81,21.97 13.34,23.5 U6.5
SCREENRST  (via drill 0.2)
  Top 0.127: LCD1.9 41.66,18.16 40.13,18.16 39.62,17.65 39.62,13.21 41.4,11.43 50.8,11.43 51.69,12.32 51.69,14.35 51.44,14.61 48.77,14.61 48.26,15.11 48.26,15.62 48.39,15.75 49.02,15.75 49.4,15.37 50.55,15.37 51.18,16 R24.2 51.31,16 51.44,15.88 v54.99,15.88 | v59.05,28.83 59.05,28.57 58.29,27.81 v58.29,23.37
  Bottom 0.127: v59.05,28.83 58.55,29.34 56.64,29.34 U6.40 | v58.29,23.37 58.29,21.46 58.42,21.34 58.42,18.03 56.26,15.88 v54.99,15.88
SDA  (via drill 0.2)
  Top 0.127: U2.4 45.85,26.16 45.34,26.16 45.21,26.04 40.39,26.04 39.62,26.8 38.35,26.8 38.1,26.54 v38.1,21.97 38.1,21.59 40.13,19.56 41.66,19.56 LCD1.11 | 10.54,28.19 11.05,28.7 17.4,28.7 18.16,27.94 U7.9 | 10.54,28.19 10.54,27.94 U5.14 10.54,28.19 | v9.91,20.57 v9.91,21.97 9.91,23.11 6.86,26.16 6.86,27.43 7.62,28.19 10.54,28.19 | v37.08,21.97 37.08,24.64 33.15,28.57 25.4,28.57 23.88,27.05 23.88,26.42 22.73,25.27 15.75,25.27 12.06,21.59 11.56,21.59 v11.3,21.84
  Bottom 0.127: v9.91,20.57 9.91,19.05 U1.9 | v9.91,21.97 10.54,22.61 | 10.54,22.61 10.79,22.86 10.79,23.5 U6.3 | v37.08,21.97 v38.1,21.97 | 10.54,22.61 v11.3,21.84
STICKCTR
  Bottom 0.127: R12.2 42.04,20.7 42.04,26.16 38.86,29.34 U6.26
STICKDOWN
  Bottom 0.127: R15.1 33.91,20.7 33.91,23.37 33.78,23.5 U6.21
STICKLEFT
  Bottom 0.127: R13.2 36.07,20.7 36.07,23.37 36.2,23.5 U6.23
STICKRIGHT
  Bottom 0.127: R11.2 39.88,20.7 39.88,25.78 36.32,29.34 U6.24
STICKUP
  Bottom 0.127: R16.1 31.88,20.7 31.88,22.86 31.24,23.5 U6.19

### Text on the board
200bmp: C:/Users/jpmendoza/Desktop/QuickPi - CIrcuit-1812(1).bmp | C:/Users/jpmendoza/Desktop/QuickPi - CIrcuit-1812(1).bmp | C:/Users/jpmendoza/Desktop/QuickPi - CIrcuit-1812.bmp